# EAGLE design SmodDIP (EAGLE 6.3)
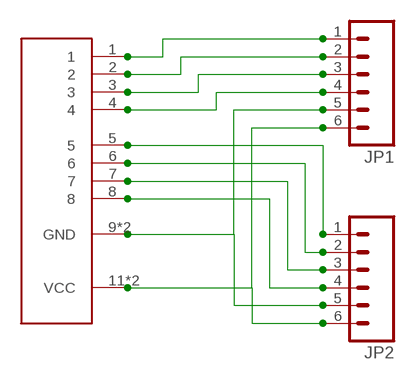
[diagram p0: schematic, sheet 1]

## Parts
JP1  M06LOCK  [1X06_LOCK]
JP2  M06LOCK  [1X06_LOCK]
U$1  PMOD  [2X6]

## Nets
GND: JP1.5 JP2.5 U$1.9(GND) U$1.10(GND)
N$1: JP1.1 U$1.1
N$2: JP1.2 U$1.2
N$3: JP1.3 U$1.3
N$4: JP1.4 U$1.4
N$7: JP2.1 U$1.5
N$8: JP2.2 U$1.6
N$9: JP2.3 U$1.7
N$10: JP2.4 U$1.8
VCC: JP1.6 JP2.6 U$1.11(VCC) U$1.12(VCC)

## Library data of the parts
JP1 JP2 = SparkFun-Connectors:M06: Header 6 Standard 6-pin 0.1" header. Use with straight break away headers (SKU : PRT-00116), right angle break away headers (PRT-00553), swiss pins (PRT-00743), machine pins (PRT-00117), and female headers (PRT-00115). Molex polarized connector foot print use with SKU : PRT-08094 with associated crimp pins and housings. NOTES ON THE VARIANTS LOCK and LOCK_LONGPADS... This footprint was designed to help hold the alignment of a through-hole component (i.e. 6-pin header) while soldering it into place. You may notice that each hole has been shifted either up or down by 0.005 of an inch from it's more standard position (which is a perfectly straight line). This slight alteration caused the pins (the squares in the middle) to touch the edges of the holes. Because they are alternating, it causes a "brace" to hold the component in place. 0.005 has proven to be the perfect amount of "off-center" position when using our standard breakaway headers. Although looks a little odd when you look at the bare footprint, once you have a header in there, the alteration is very hard to notice. Also, if you push a header all the way into place, it is covered up entirely on the bottom side. This idea of altering the position of holes to aid alignment will be further integrated into the Sparkfun Library for other footprints. It can help hold any component with 3 or more connection pins.
U$1 = Strutz Electronic Industries:PMOD

## Board
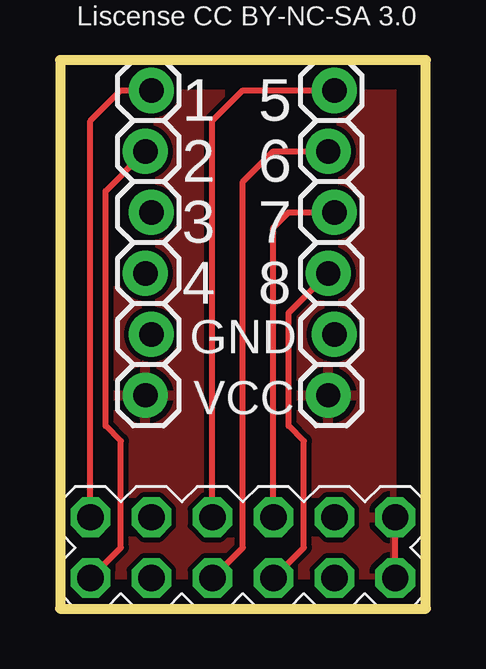
[diagram p1: board, top side]
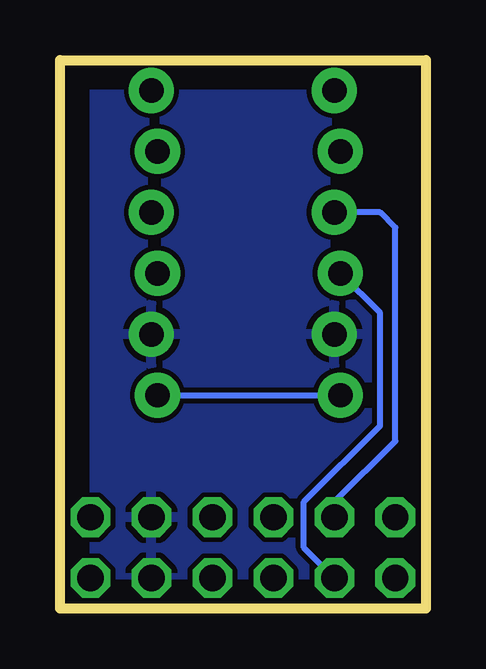
[diagram p2: board, bottom side, seen from below]

Size 15.24 x 22.86 mm. Coordinates in mm from the lower left corner, seen from the top.
Outline: 0,0 15.24,0 15.24,22.86 0,22.86 0,0
Copper layers (1*16): Top 0.035mm / dielectric 1.5mm / Bottom 0.035mm
Design rules "default": minimum track width 10mil, minimum drill 24mil, track to track 8mil, track to pad 8mil, pad to pad 8mil, via to via 8mil, smd to smd 8mil, copper to edge 40mil, drill to drill 8mil, minimum pad ring 10mil, minimum via ring 8mil, stop-mask expansion 4mil, vias tented up to drill 0mil, thermal gap 10mil

### Footprints (pad centres in the part's own frame; a part is rotated, then mirrored left to right if it is on the bottom)
1X06_LOCK = drill 1.016 pad 1.88: 1 0,0; 2 2.54,-0.254; 3 5.08,0; 4 7.62,-0.254; 5 10.16,0; 6 12.7,-0.254
2X6 = drill 1.1 octagon: 1 -6.35,1.27; 2 -6.35,-1.27; 3 -3.81,1.27; 4 -3.81,-1.27; 5 -1.27,1.27; 6 -1.27,-1.27; 7 1.27,1.27; 8 1.27,-1.27; 9 3.81,1.27; 10 3.81,-1.27; 11 6.35,1.27; 12 6.35,-1.27

### Placement (x,y rotation side)
JP1  3.81,21.59 270 top
JP2  11.43,21.59 270 top
U$1  7.62,2.54 0 top

### Tracks (layer width: path | path; a pad name or v marks a point on that pad's centre or on a via)
GND
  pour Bottom: 0,0 15.24,0 15.24,22.86 0,22.86
N$1
  Top 0.254: U$1.1 1.27,20.32 2.54,21.59 JP1.1
N$2
  Top 0.254: U$1.2 2.54,2.54 2.54,6.99 1.91,7.62 1.91,17.4 JP1.2
N$3
  Bottom 0.254: U$1.3 3.81,4.45 1.27,6.99 1.27,15.88 1.91,16.51 JP1.3
N$4
  Bottom 0.254: U$1.4 5.08,2.54 5.08,4.45 1.91,7.62 1.91,12.32 JP1.4
N$7
  Top 0.254: U$1.5 6.35,20.32 7.62,21.59 JP2.1
N$8
  Top 0.254: U$1.6 7.62,2.54 7.62,17.78 8.89,19.05 JP2.2
N$9
  Top 0.254: U$1.7 8.89,15.88 9.52,16.51 JP2.3
N$10
  Top 0.254: U$1.8 10.16,2.54 10.16,6.99 9.52,7.62 9.52,12.32 JP2.4
VCC
  Top 0.254: U$1.12 U$1.11
  Bottom 0.254: JP2.6 JP1.6
  pour Top: 0,0 15.24,0 15.24,22.86 0,22.86

### Text on the board
tSilk: 1 | 5 | 2 | 6 | 3 | 7 | 4 | 8 | GND | VCC
_tsilk: Made by Shannon Strutz / For the University of Wisconsin - Stout / 2013 / / Liscense CC BY-NC-SA 3.0